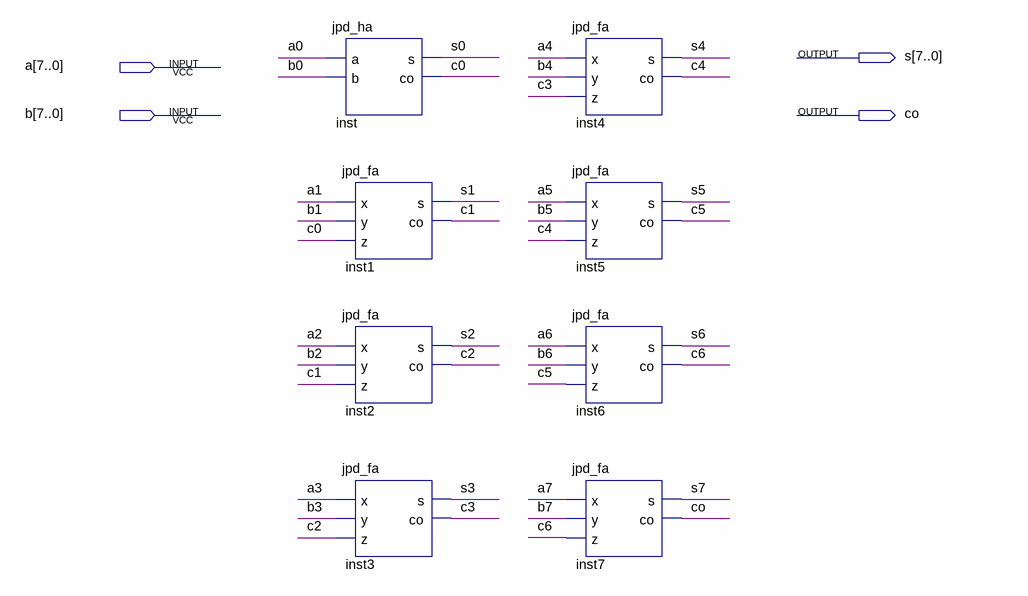
[diagram p0: schematic sheet]
// Quartus schematic jpd_s8bit.bdf as structural Verilog: 8 symbols, 4 pins
module jpd_s8bit (
  input  [7:0] a,
  input  [7:0] b,
  output [7:0] s,
  output co
);

  wire c0, c1, c2, c3, c4, c5, c6;

  jpd_ha inst (.a(a[0]), .b(b[0]), .s(s[0]), .co(c0));
  jpd_fa inst1 (.x(a[1]), .y(b[1]), .z(c0), .s(s[1]), .co(c1));
  jpd_fa inst2 (.x(a[2]), .y(b[2]), .z(c1), .s(s[2]), .co(c2));
  jpd_fa inst3 (.x(a[3]), .y(b[3]), .z(c2), .s(s[3]), .co(c3));
  jpd_fa inst4 (.x(a[4]), .y(b[4]), .z(c3), .s(s[4]), .co(c4));
  jpd_fa inst5 (.x(a[5]), .y(b[5]), .z(c4), .s(s[5]), .co(c5));
  jpd_fa inst6 (.x(a[6]), .y(b[6]), .z(c5), .s(s[6]), .co(c6));
  jpd_fa inst7 (.x(a[7]), .y(b[7]), .z(c6), .s(s[7]), .co(co));
endmodule
